# Altium schematic sheet Sheet1.SchDoc
size A4
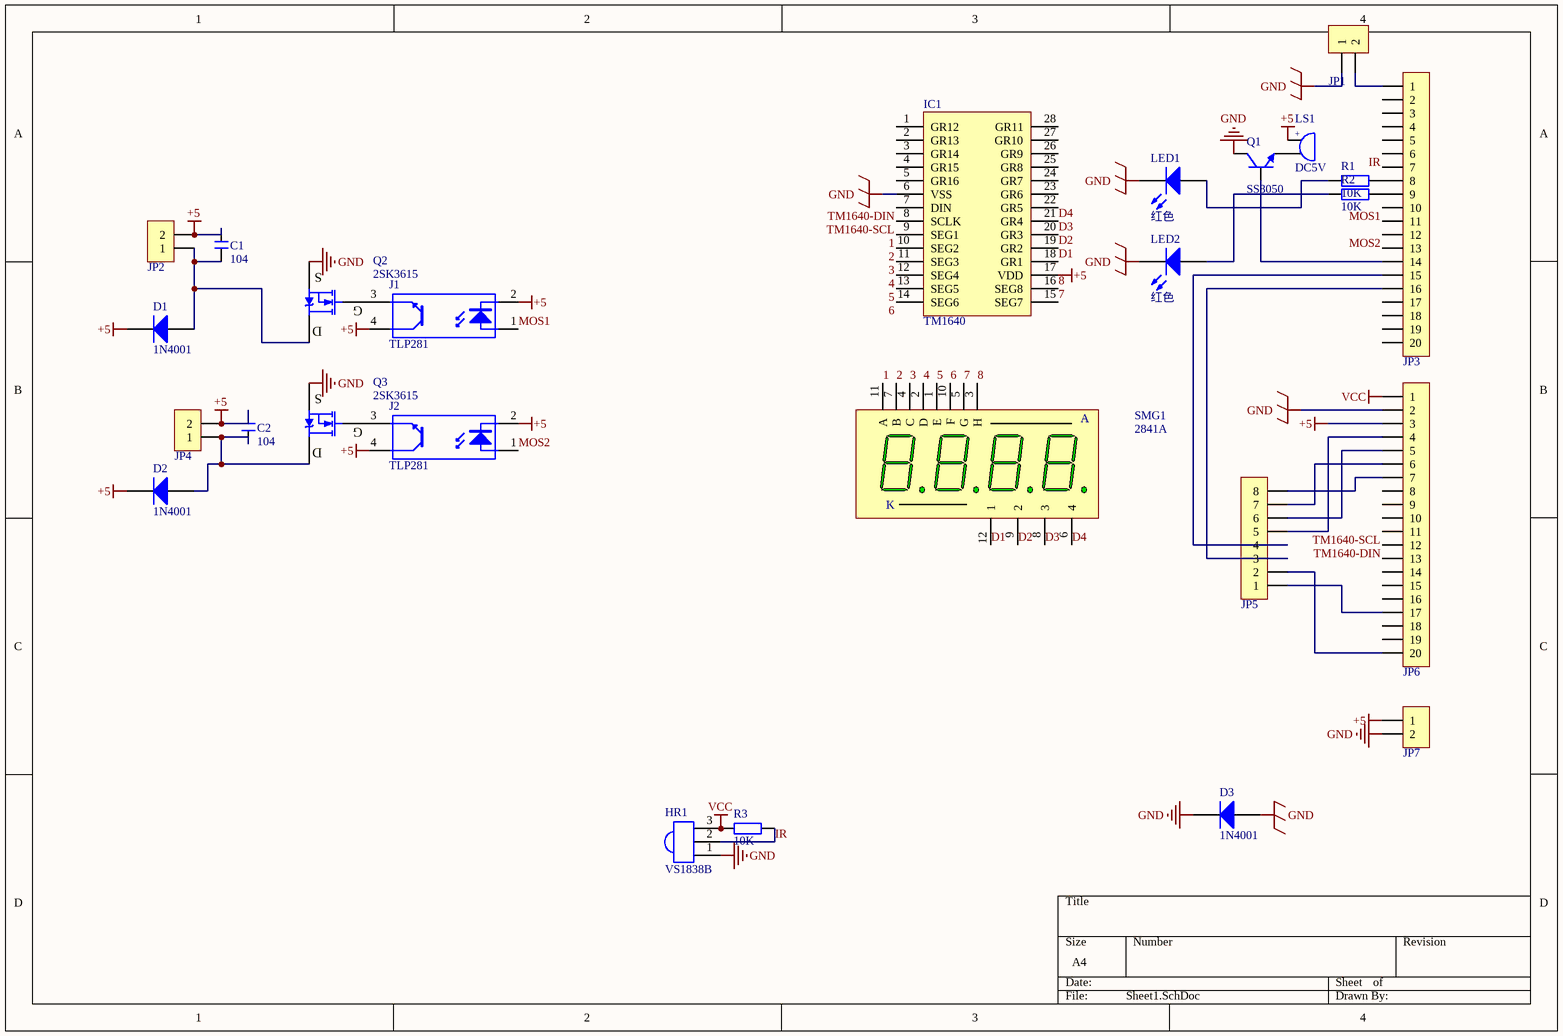
[diagram p0: Sheet1.SchDoc]

## Parts
C1  104  [C 0805_L]
C2  104  [C 0805_L]
D1  Type: 1N4001  [DIODE-AXL]  (hidden comment: Diode)
D2  Type: 1N4001  [DIODE-AXL]  (hidden comment: Diode)
D3  Type: 1N4001  [DIODE-AXL]  (hidden comment: Diode)
HR1  VS1838B  [VS1838B-B]
IC1  TM1640  [SOP28_L]
J1  TLP281  [DIP4-300]
J2  TLP281  [DIP4-300]
JP1  HDR-1X2  [HDR2.54-LI-2P]  (value not drawn)
JP2  HDR-1X2  [KF2EDGK5.08-LI-2P]  (value not drawn)
JP3  HDR-1X20  [HDR2.54-M-LI-20P]  (value not drawn)
JP4  HDR-1X2  [KF2EDGK5.08-LI-2P]  (value not drawn)
JP5  HDR-1X8  [HDR2.54-M-LI-8P]  (value not drawn)
JP6  HDR-1X20  [HDR2.54-M-LI-20P]  (value not drawn)
JP7  HDR-1X2  [KF2EDGK5.08-LI-2P]  (value not drawn)
LED1  红色  [LED 3MM-B]
LED2  红色  [LED 3MM-B]
LS1  DC5V  [BEEP 5x9x5.5]
Q1  SS8050  [TO92A]
Q2  2SK3615  [TO252]
Q3  2SK3615  [TO252]
R1  10K  [R 0805_L]
R2  10K  [R 0805_L]
R3  10K  [R 0805_L]
SMG1  2841A  [SMG 0.28-4P_B]

## Nets
+5: C1.2 C2.2 D1.2(K) D2.2(K) IC1.17(VDD) J1.2(K) J1.4(C) J2.2(K) J2.4(C) JP2.2 JP4.2 JP6.3 JP7.1 LS1.1
GND: D3.1(A) D3.2(K) HR1.1(A) IC1.6(VSS) JP1.1 JP6.2 JP7.2 LED1.2(K) LED2.2(K) Q1.3(C) Q2.3(S) Q3.3(S)
VCC: HR1.3(E) JP6.1 R3.1
1: IC1.9(SEG1) SMG1.11(A)
2: IC1.10(SEG2) SMG1.7(B)
3: IC1.11(SEG3) SMG1.4(C)
4: IC1.12(SEG4) SMG1.2(D)
5: IC1.13(SEG5) SMG1.1(E)
6: IC1.14(SEG6) SMG1.10(F)
7: IC1.15(SEG7) SMG1.5(G)
8: IC1.16(SEG8) SMG1.3(H)
D1: IC1.18(GR1) SMG1.12(1)
D2: IC1.19(GR2) SMG1.9(2)
D3: IC1.20(GR3) SMG1.8(3)
D4: IC1.21(GR4) SMG1.6(4)
IR: HR1.2(K) JP3.6 R3.2
MOS1: J1.1(A) JP3.10
MOS2: J2.1(A) JP3.12
TM1640-DIN: IC1.7(DIN) JP6.12
TM1640-SCL: IC1.8(SCLK) JP6.11
NetC1_1: C1.1 D1.1(A) JP2.1 Q2.2(D)
NetC2_1: C2.1 D2.1(A) JP4.1 Q3.2(D)
NetJ1_3: J1.3(E) Q2.1(G)
NetJ2_3: J2.3(E) Q3.1(G)
NetJP1_2: JP1.2 JP3.1
NetJP3_8: JP3.8 R1.2
NetJP3_9: JP3.9 R2.2
NetJP3_14: JP3.14 Q1.2(B)
NetJP3_15: JP3.15 JP5.4
NetJP3_16: JP3.16 JP5.3
NetJP5_1: JP5.1 JP6.17
NetJP5_2: JP5.2 JP6.20
NetJP5_5: JP5.5 JP6.4
NetJP5_6: JP5.6 JP6.5
NetJP5_7: JP5.7 JP6.6
NetJP5_8: JP5.8 JP6.7
NetLED1_1: LED1.1(A) R1.1
NetLED2_1: LED2.1(A) R2.1
NetLS1_2: LS1.2 Q1.1(E)

Not connected (* = marked no-connect by the designer): IC1 1(GR12) 2(GR13) 3(GR14) 4(GR15) 5(GR16) 22(GR5) 23(GR6) 24(GR7) 25(GR8) 26(GR9) 27(GR10) 28(GR11); JP3 2 3 4 5 7 11 13 17 18 19 20; JP6 8 9 10 13 14 15 16 18 19

## Notes on the sheet
- (in symbol 2841A) K
- (in symbol BEEP) +

## Library data of the parts
C1 C2 = C: 贴片电容; BOM名称: 无极性贴片电容; 淘宝ID: 封装库来自淘宝 ID：黄晶宝石; 联系售后，技术支持: https://shop463601444.taobao.com; 唯一出售店铺网址: https://shop463601444.taobao.com
D1-D3 = Diode: 二极管; Published: 8-Jun-2000; LatestRevisionDate: 17-Jul-2002; LatestRevisionNote: Re-released for DXP Platform.; PackageDocument: Sep-1996; PackageReference: SMC; Publisher: Altium Limited; Code_JEDEC: DO-214-AB
HR1 = VS1838B: 红外接收头; 版权归属: 封装库来自淘宝 ID：黄晶宝石; BOM名称: 红外接收头; 技术支持，联系售后: https://shop463601444.taobao.com
IC1 = TM1640: LED驱动控制芯片; 版权归属: 封装库来自淘宝 ID：黄晶宝石; BOM名称: LED驱动控制芯片; 学习资源: https://shop463601444.taobao.com
J1 J2 = TLP281: 光耦; Published: 24-Mar-1999; LatestRevisionDate: 04-Mar-2005; LatestRevisionNote: Sch pins 3 & 4 Swapped.; DatasheetDocument: Nov-2003; PackageReference: DIP-4; Publisher: Altium Limited
JP1 = Header 2: 2P接插件; 版权归属: 封装库来自淘宝 ID：黄晶宝石; BOM名称: 2P接插件; 联系售后: https://shop463601444.taobao.com
JP2 JP4 JP7 = Header 2: 2P接插件; 版权归属: 封装库来自淘宝卖家 ID：黄晶宝石; BOM名称: 2P接插件; 学习资源: https://shop463601444.taobao.com
JP3 JP6 = Header 20: 20P接插件; 版权归属: 封装库来自淘宝 ID：黄晶宝石; BOM名称: 20P接插件; 学习资源: https://shop463601444.taobao.com
JP5 = Header 8: 8P接插件; 版权归属: 封装库来自淘宝 ID：黄晶宝石; BOM名称: 8P接插件; 学习资源: https://shop463601444.taobao.com
LED1 LED2 = LED-3MM: 直插3mm LED; BOM名称: 插件LED; 版权归属: 封装库来自淘宝 ID：黄晶宝石; 联系售后: https://shop463601444.taobao.com
LS1 = BEEP: 蜂鸣器; 版权归属: 封装库来自淘宝 ID：黄晶宝石; BOM名称: 蜂鸣器; 技术支持，联系售后: https://shop463601444.taobao.com
Q1 = 8050-DIP: 高频放大-NPN型; 版权归属: 封装库来自淘宝 ID：黄晶宝石; 属性: 40V 1.5A 1W 100MHZ; BOM名称: 高频放大-NPN型; 技术支持，联系售后: https://shop463601444.taobao.com
Q2 Q3 = 2SK3615: N沟场效应管; 技术支持，联系售后: 其他店铺购入均为盗版，不享受售后技术支持服务，请立即申请退款; BOM名称: N沟场效应管; 学习资源: https://shop463601444.taobao.com
R1-R3 = R: 贴片电阻; 版权归属: 来自淘宝 ID：黄晶宝石; 封装库来自淘宝卖家 ID：黄晶宝石: 其他店铺购入均为盗版，不享受售后技术支持服务，请立即申请退款; BOM名称: 贴片电阻; 联系售后: https://shop463601444.taobao.com
SMG1 = 2841A: 0.28寸4位共阴数码管; 版权归属: 封装库来自淘宝 ID：黄晶宝石; BOM名称: 0.28寸4位共阴; 学习资源: https://shop463601444.taobao.com